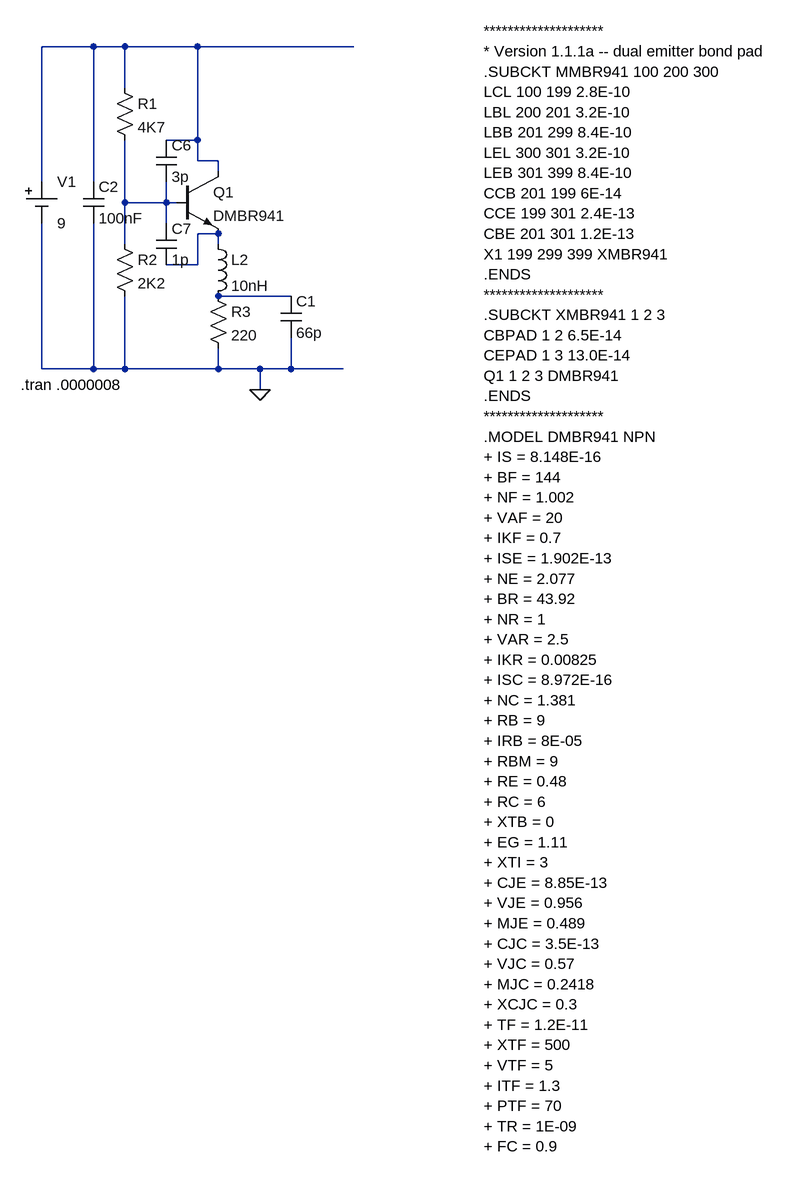
[diagram p0: schematic rcwl-0516.asc]
rcwl-0516.asc, the LTspice schematic file:
Version 4
SHEET 1 1072 1484
WIRE 16 -48 -64 -48
WIRE 64 -48 16 -48
WIRE 176 -48 64 -48
WIRE 416 -48 176 -48
WIRE 64 16 64 -48
WIRE 176 96 176 -48
WIRE 176 96 128 96
WIRE 176 128 176 96
WIRE 208 128 176 128
WIRE 208 144 208 128
WIRE -64 160 -64 -48
WIRE 16 160 16 -48
WIRE 64 192 64 96
WIRE 128 192 128 160
WIRE 128 192 64 192
WIRE 144 192 128 192
WIRE 128 224 128 192
WIRE 208 240 176 240
WIRE 64 256 64 192
WIRE 208 256 208 240
WIRE 176 288 176 240
WIRE 176 288 128 288
WIRE 320 336 208 336
WIRE -64 448 -64 224
WIRE 16 448 16 224
WIRE 16 448 -64 448
WIRE 64 448 64 336
WIRE 64 448 16 448
WIRE 208 448 208 416
WIRE 208 448 64 448
WIRE 272 448 208 448
WIRE 320 448 320 400
WIRE 320 448 272 448
WIRE 400 448 320 448
WIRE 272 480 272 448
FLAG 272 480 0
SYMBOL npn 144 144 R0
SYMATTR InstName Q1
SYMATTR Value DMBR941
SYMBOL res 48 0 R0
SYMATTR InstName R1
SYMATTR Value 4K7
SYMBOL res 48 240 R0
SYMATTR InstName R2
SYMATTR Value 2K2
SYMBOL res 192 320 R0
SYMATTR InstName R3
SYMATTR Value 220
SYMBOL Misc\\cell -64 160 R0
WINDOW 123 0 0 Left 2
WINDOW 39 0 0 Left 2
SYMATTR InstName V1
SYMATTR Value 9
SYMBOL ind 192 240 R0
SYMATTR InstName L2
SYMATTR Value 10nH
SYMBOL cap 112 96 R0
SYMATTR InstName C6
SYMATTR Value 3p
SYMBOL cap 112 224 R0
SYMATTR InstName C7
SYMATTR Value 1p
SYMBOL cap 304 336 R0
SYMATTR InstName C1
SYMATTR Value 66p
SYMBOL cap 0 160 R0
SYMATTR InstName C2
SYMATTR Value 100nF
TEXT -96 472 Left 2 !.tran .0000008
TEXT 616 -72 Left 2 !********************\n* Version 1.1.1a -- dual emitter bond pad\n.SUBCKT MMBR941 100 200 300 \nLCL 100 199 2.8E-10 \nLBL 200 201 3.2E-10 \nLBB 201 299 8.4E-10 \nLEL 300 301 3.2E-10 \nLEB 301 399 8.4E-10 \nCCB 201 199 6E-14 \nCCE 199 301 2.4E-13 \nCBE 201 301 1.2E-13 \nX1 199 299 399 XMBR941\n.ENDS\n********************\n.SUBCKT XMBR941 1 2 3 \nCBPAD 1 2 6.5E-14 \nCEPAD 1 3 13.0E-14 \nQ1 1 2 3 DMBR941 \n.ENDS\n********************\n.MODEL DMBR941 NPN \n+ IS = 8.148E-16 \n+ BF = 144 \n+ NF = 1.002 \n+ VAF = 20 \n+ IKF = 0.7 \n+ ISE = 1.902E-13 \n+ NE = 2.077 \n+ BR = 43.92 \n+ NR = 1 \n+ VAR = 2.5 \n+ IKR = 0.00825 \n+ ISC = 8.972E-16 \n+ NC = 1.381 \n+ RB = 9 \n+ IRB = 8E-05 \n+ RBM = 9 \n+ RE = 0.48 \n+ RC = 6 \n+ XTB = 0 \n+ EG = 1.11 \n+ XTI = 3 \n+ CJE = 8.85E-13 \n+ VJE = 0.956 \n+ MJE = 0.489 \n+ CJC = 3.5E-13 \n+ VJC = 0.57 \n+ MJC = 0.2418 \n+ XCJC = 0.3 \n+ TF = 1.2E-11 \n+ XTF = 500 \n+ VTF = 5 \n+ ITF = 1.3 \n+ PTF = 70 \n+ TR = 1E-09 \n+ FC = 0.9

The netlist it stands for:
* rcwl-0516.asc
Q1 N001 N002 N003 0 DMBR941
R1 N001 N002 4K7
R2 N002 0 2K2
R3 N004 0 220
V1 N001 0 9
L2 N003 N004 10nH
C6 N001 N002 3p
C7 N002 N003 1p
C1 N004 0 66p
C2 N001 0 100nF
.model NPN NPN
.model PNP PNP
.lib standard.bjt
.tran .0000008
********************
* Version 1.1.1a -- dual emitter bond pad
.SUBCKT MMBR941 100 200 300
LCL 100 199 2.8E-10
LBL 200 201 3.2E-10
LBB 201 299 8.4E-10
LEL 300 301 3.2E-10
LEB 301 399 8.4E-10
CCB 201 199 6E-14
CCE 199 301 2.4E-13
CBE 201 301 1.2E-13
X1 199 299 399 XMBR941
.ENDS
********************
.SUBCKT XMBR941 1 2 3
CBPAD 1 2 6.5E-14
CEPAD 1 3 13.0E-14
Q1 1 2 3 DMBR941
.ENDS
********************
.MODEL DMBR941 NPN
+ IS = 8.148E-16
+ BF = 144
+ NF = 1.002
+ VAF = 20
+ IKF = 0.7
+ ISE = 1.902E-13
+ NE = 2.077
+ BR = 43.92
+ NR = 1
+ VAR = 2.5
+ IKR = 0.00825
+ ISC = 8.972E-16
+ NC = 1.381
+ RB = 9
+ IRB = 8E-05
+ RBM = 9
+ RE = 0.48
+ RC = 6
+ XTB = 0
+ EG = 1.11
+ XTI = 3
+ CJE = 8.85E-13
+ VJE = 0.956
+ MJE = 0.489
+ CJC = 3.5E-13
+ VJC = 0.57
+ MJC = 0.2418
+ XCJC = 0.3
+ TF = 1.2E-11
+ XTF = 500
+ VTF = 5
+ ITF = 1.3
+ PTF = 70
+ TR = 1E-09
+ FC = 0.9
.backanno
.end